# Altium schematic sheet STM32F7.SchDoc
size A3; SheetSize: A4
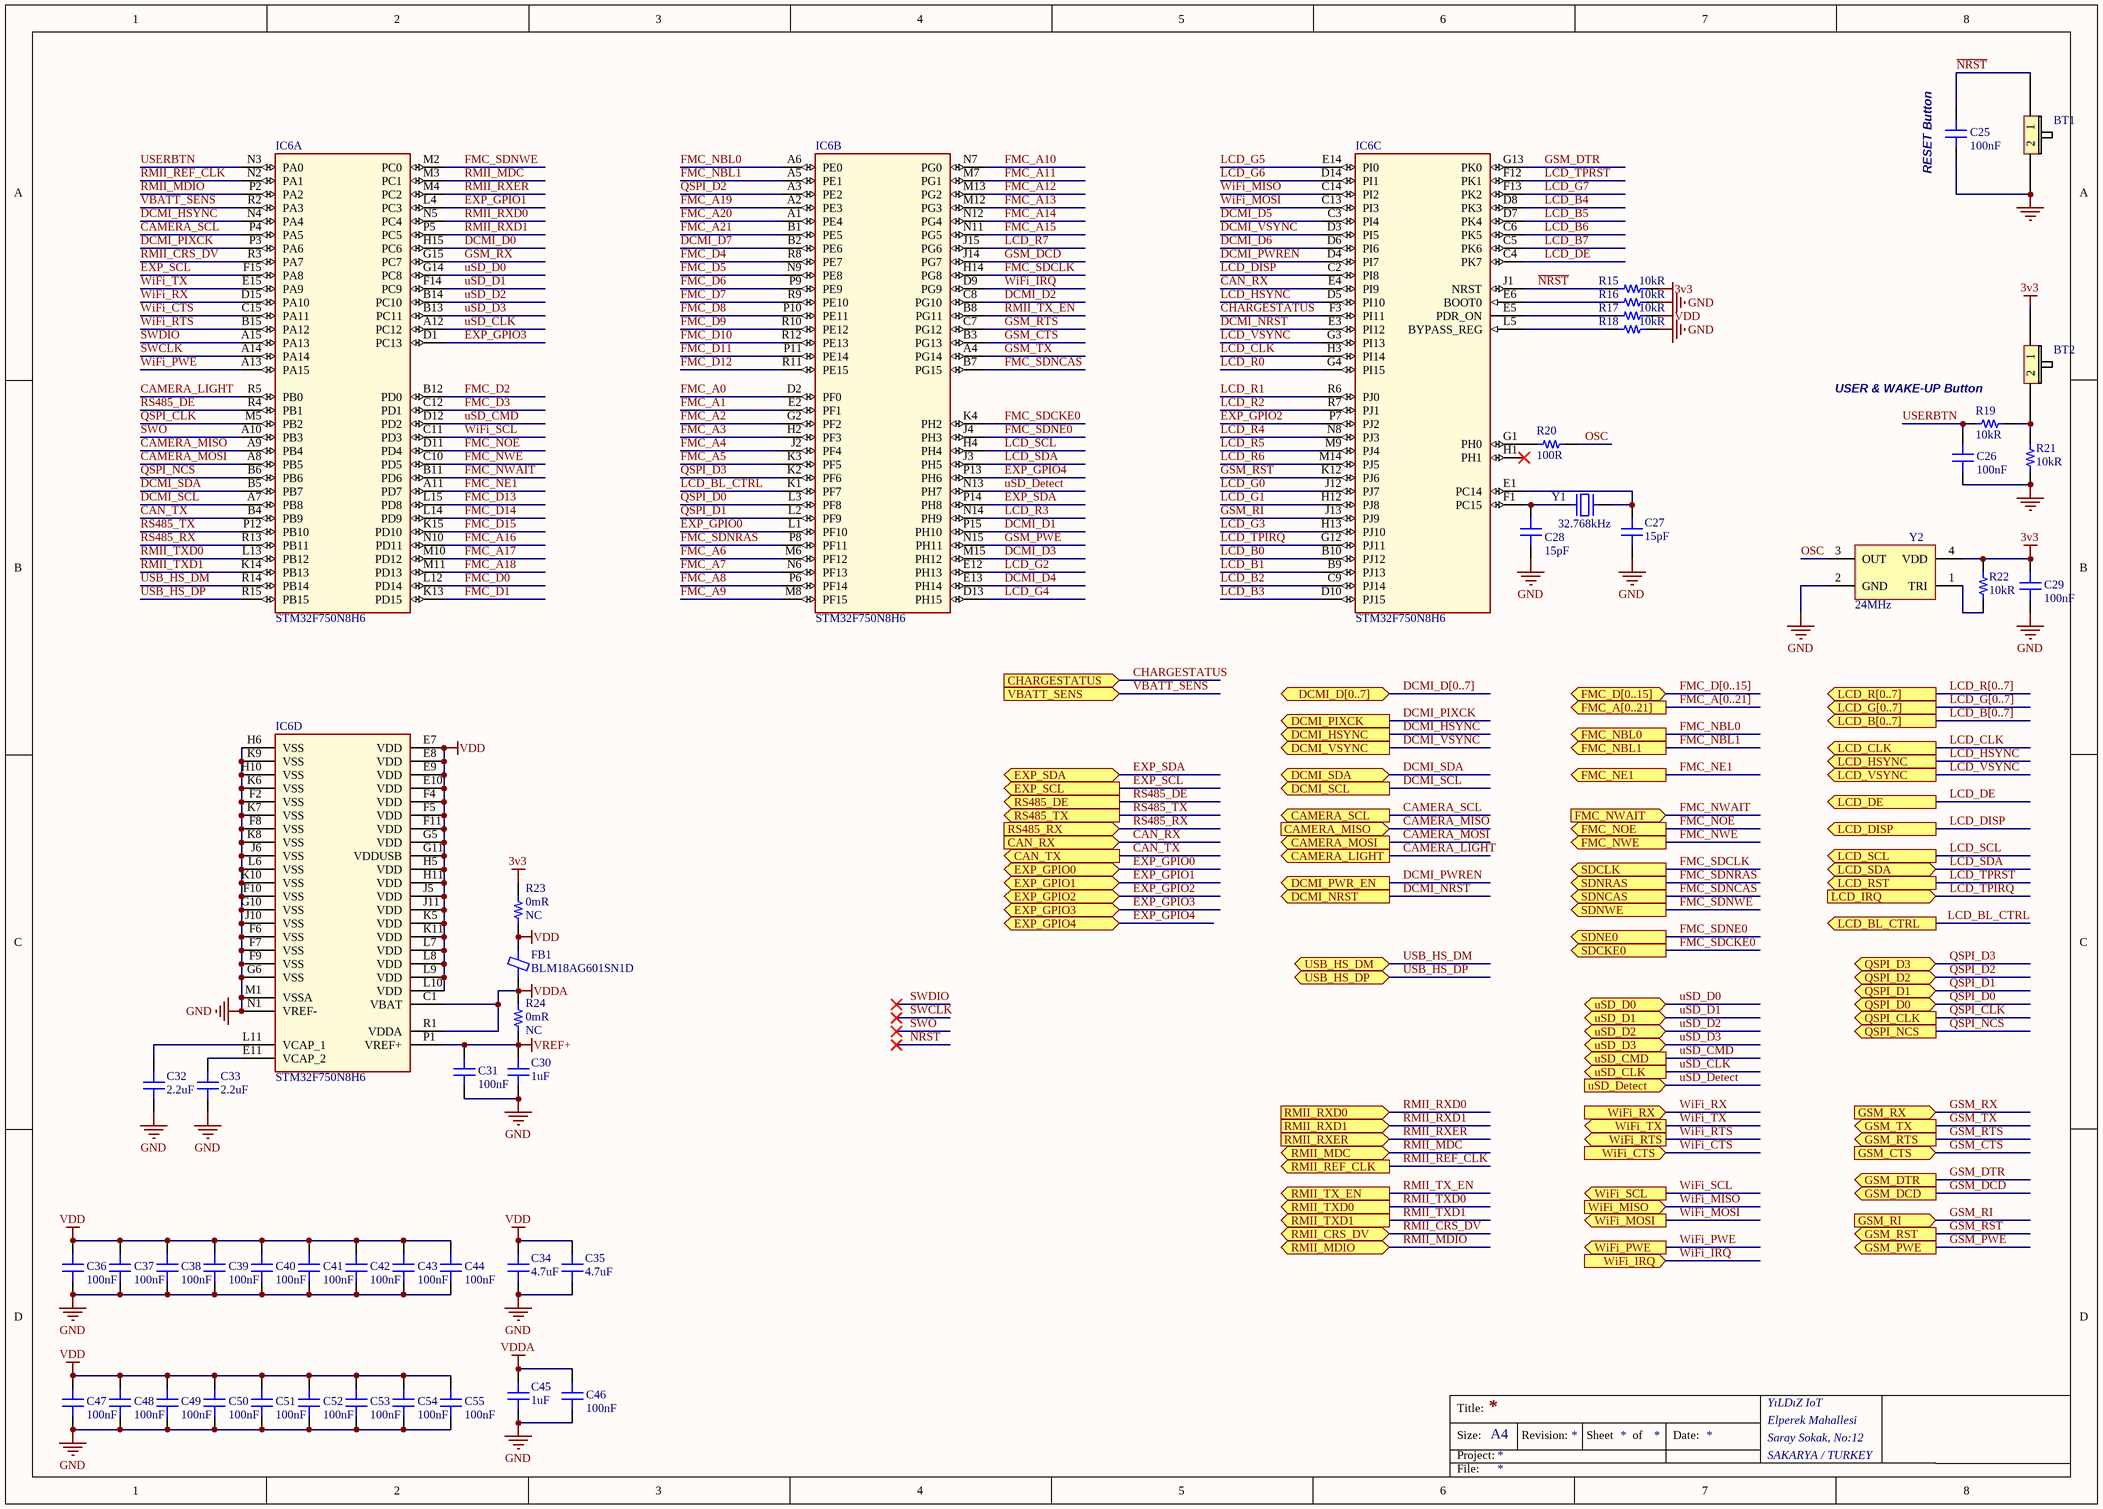
[diagram p0: STM32F7.SchDoc]

## Parts
BT1  EVQP7J01P  [TactileButton]  (value not drawn)
BT2  EVQP7J01P  [TactileButton]  (value not drawn)
C25  100nF  [CAP 0603/1608]  (no BOM)
C26  100nF  [CAP 0603/1608]
C27  15pF  [CAP 0603/1608]
C28  15pF  [CAP 0603/1608]
C29  100nF  [CAP 0603/1608]
C30  1uF  [CAP 0603/1608]
C31  100nF  [CAP 0603/1608]
C32  2.2uF  [CAP 0603/1608]
C33  2.2uF  [CAP 0603/1608]
C34  4.7uF  [CAP 0603/1608]
C35  4.7uF  [CAP 0603/1608]
C36  100nF  [CAP 0603/1608]
C37  100nF  [CAP 0603/1608]
C38  100nF  [CAP 0603/1608]
C39  100nF  [CAP 0603/1608]
C40  100nF  [CAP 0603/1608]
C41  100nF  [CAP 0603/1608]
C42  100nF  [CAP 0603/1608]
C43  100nF  [CAP 0603/1608]
C44  100nF  [CAP 0603/1608]
C45  1uF  [CAP 0603/1608]
C46  100nF  [CAP 0603/1608]
C47  100nF  [CAP 0603/1608]
C48  100nF  [CAP 0603/1608]
C49  100nF  [CAP 0603/1608]
C50  100nF  [CAP 0603/1608]
C51  100nF  [CAP 0603/1608]
C52  100nF  [CAP 0603/1608]
C53  100nF  [CAP 0603/1608]
C54  100nF  [CAP 0603/1608]
C55  100nF  [CAP 0603/1608]
FB1  BLM18AG601SN1D  [FER 0603/1608]
IC6  STM32F750N8H6  [ST TFBGA-216 13x13 0.8mm]  (parts A,B,C,D of 4)
R15  10kR  [RES 0603/1608]
R16  10kR  [RES 0603/1608]
R17  10kR  [RES 0603/1608]
R18  10kR  [RES 0603/1608]
R19  10kR  [RES 0603/1608]
R20  100R  [RES 0603/1608]  (no BOM)
R21  10kR  [RES 0603/1608]
R22  10kR  [RES 0603/1608]
R23  0mR  [RES 0603/1608]  (no BOM)
R24  0mR  [RES 0603/1608]  (no BOM)
Y1  32.768kHz  [ABRACON ABS06]
Y2  24MHz  [Abracon ASTX-11]

## Ports
CAMERA_LIGHT (out), CAMERA_MISO (in), CAMERA_MOSI (out), CAMERA_SCL (out), CAN_RX (in), CAN_TX (out), CHARGESTATUS (in), DCMI_D[0..7] (bidir), DCMI_HSYNC (out), DCMI_NRST (out), DCMI_PIXCK (out), DCMI_PWR_EN (out), DCMI_SCL (out), DCMI_SDA (bidir), DCMI_VSYNC (out), EXP_GPIO0 (bidir), EXP_GPIO1 (bidir), EXP_GPIO2 (bidir), EXP_GPIO3 (bidir), EXP_GPIO4 (bidir), EXP_SCL (out), EXP_SDA (bidir), FMC_A[0..21] (out), FMC_D[0..15] (bidir), FMC_NBL0 (out), FMC_NBL1 (out), FMC_NE1 (out), FMC_NOE (out), FMC_NWAIT (in), FMC_NWE (out), GSM_CTS (in), GSM_DCD (out), GSM_DTR (out), GSM_PWE (out), GSM_RI (in), GSM_RST (out), GSM_RTS (out), GSM_RX (in), GSM_TX (out), LCD_B[0..7] (out), LCD_BL_CTRL (out), LCD_CLK (out), LCD_DE (out), LCD_DISP (out), LCD_G[0..7] (out), LCD_HSYNC (out), LCD_IRQ (in), LCD_R[0..7] (out), LCD_RST (out), LCD_SCL (out), LCD_SDA (bidir), LCD_VSYNC (out), QSPI_CLK (out), QSPI_D0 (bidir), QSPI_D1 (bidir), QSPI_D2 (bidir), QSPI_D3 (bidir), QSPI_NCS (out), RMII_CRS_DV (bidir), RMII_MDC (bidir), RMII_MDIO (bidir), RMII_REF_CLK (out), RMII_RXD0 (in), RMII_RXD1 (in), RMII_RXER (in), RMII_TX_EN (out), RMII_TXD0 (out), RMII_TXD1 (out), RS485_DE (out), RS485_RX (in), RS485_TX (out), SDCKE0 (out), SDCLK (out), SDNCAS (out), SDNE0 (out), SDNRAS (out), SDNWE (out), USB_HS_DM (bidir), USB_HS_DP (bidir), uSD_CLK (out), uSD_CMD (out), uSD_D0 (bidir), uSD_D1 (bidir), uSD_D2 (bidir), uSD_D3 (bidir), uSD_Detect (in), VBATT_SENS (in), WiFi_CTS (in), WiFi_IRQ (in), WiFi_MISO (in), WiFi_MOSI (out), WiFi_PWE (out), WiFi_RTS (out), WiFi_RX (in), WiFi_SCL (out), WiFi_TX (out)

## Nets
3v3: BT2.1 C29.2 R15.1 R22.1 R23.2 Y2.4(VDD)
GND: BT1.2 C25.1 C26.1 C27.1 C28.1 C29.1 C30.1 C31.1 C32.1 C33.1 C34.1 C35.1 C36.1 C37.1 C38.1 C39.1 C40.1 C41.1 C42.1 C43.1 C44.1 C45.1 C46.1 C47.1 C48.1 C49.1 C50.1 C51.1 C52.1 C53.1 C54.1 C55.1 IC6.F2(VSS) IC6.F6(VSS) IC6.F7(VSS) IC6.F8(VSS) IC6.F9(VSS) IC6.F10(VSS) IC6.G6(VSS) IC6.G10(VSS) IC6.H6(VSS) IC6.H10(VSS) IC6.J6(VSS) IC6.J10(VSS) IC6.K6(VSS) IC6.K7(VSS) IC6.K8(VSS) IC6.K9(VSS) IC6.K10(VSS) IC6.L6(VSS) IC6.M1(VSSA) IC6.N1(VREF-) R16.1 R18.1 R21.1 Y2.2(GND)
VDD: C34.2 C35.2 C36.2 C37.2 C38.2 C39.2 C40.2 C41.2 C42.2 C43.2 C44.2 C47.2 C48.2 C49.2 C50.2 C51.2 C52.2 C53.2 C54.2 C55.2 FB1.2 IC6.E7(VDD) IC6.E8(VDD) IC6.E9(VDD) IC6.E10(VDD) IC6.F4(VDD) IC6.F5(VDD) IC6.F11(VDD) IC6.G5(VDD) IC6.G11(VDDUSB) IC6.H5(VDD) IC6.H11(VDD) IC6.J5(VDD) IC6.J11(VDD) IC6.K5(VDD) IC6.K11(VDD) IC6.L7(VDD) IC6.L8(VDD) IC6.L9(VDD) IC6.L10(VDD) R17.1 R23.1
VDDA: C45.2 C46.2 FB1.1 IC6.C1(VBAT) IC6.R1(VDDA) R24.2
VREF+: C30.2 C31.2 IC6.P1(VREF+) R24.1
CAMERA_LIGHT: IC6.R5(PB0) ; port CAMERA_LIGHT
CAMERA_MISO: IC6.A9(PB4) ; port CAMERA_MISO
CAMERA_MOSI: IC6.A8(PB5) ; port CAMERA_MOSI
CAMERA_SCL: IC6.P4(PA5) ; port CAMERA_SCL
CAN_RX: IC6.E4(PI9) ; port CAN_RX
CAN_TX: IC6.B4(PB9) ; port CAN_TX
CHARGESTATUS: IC6.F3(PI11) ; port CHARGESTATUS
DCMI_D0: IC6.H15(PC6)
DCMI_D1: IC6.P15(PH10)
DCMI_D2: IC6.C8(PG10)
DCMI_D3: IC6.M15(PH12)
DCMI_D4: IC6.E13(PH14)
DCMI_D5: IC6.C3(PI4)
DCMI_D6: IC6.D6(PI6)
DCMI_D7: IC6.B2(PE6)
DCMI_HSYNC: IC6.N4(PA4) ; port DCMI_HSYNC
DCMI_NRST: IC6.E3(PI12) ; port DCMI_NRST
DCMI_PIXCK: IC6.P3(PA6) ; port DCMI_PIXCK
DCMI_PWREN: IC6.D4(PI7) ; port DCMI_PWR_EN
DCMI_SCL: IC6.A7(PB8) ; port DCMI_SCL
DCMI_SDA: IC6.B5(PB7) ; port DCMI_SDA
DCMI_VSYNC: IC6.D3(PI5) ; port DCMI_VSYNC
EXP_GPIO0: IC6.L1(PF10) ; port EXP_GPIO0
EXP_GPIO1: IC6.L4(PC3) ; port EXP_GPIO1
EXP_GPIO2: IC6.P7(PJ2) ; port EXP_GPIO2
EXP_GPIO3: IC6.D1(PC13) ; port EXP_GPIO3
EXP_GPIO4: IC6.P13(PH6) ; port EXP_GPIO4
EXP_SCL: IC6.F15(PA8) ; port EXP_SCL
EXP_SDA: IC6.P14(PH8) ; port EXP_SDA
FMC_A0: IC6.D2(PF0)
FMC_A1: IC6.E2(PF1)
FMC_A2: IC6.G2(PF2)
FMC_A3: IC6.H2(PF3)
FMC_A4: IC6.J2(PF4)
FMC_A5: IC6.K3(PF5)
FMC_A6: IC6.M6(PF12)
FMC_A7: IC6.N6(PF13)
FMC_A8: IC6.P6(PF14)
FMC_A9: IC6.M8(PF15)
FMC_A10: IC6.N7(PG0)
FMC_A11: IC6.M7(PG1)
FMC_A12: IC6.M13(PG2)
FMC_A13: IC6.M12(PG3)
FMC_A14: IC6.N12(PG4)
FMC_A15: IC6.N11(PG5)
FMC_A16: IC6.N10(PD11)
FMC_A17: IC6.M10(PD12)
FMC_A18: IC6.M11(PD13)
FMC_A19: IC6.A2(PE3)
FMC_A20: IC6.A1(PE4)
FMC_A21: IC6.B1(PE5)
FMC_D0: IC6.L12(PD14)
FMC_D1: IC6.K13(PD15)
FMC_D2: IC6.B12(PD0)
FMC_D3: IC6.C12(PD1)
FMC_D4: IC6.R8(PE7)
FMC_D5: IC6.N9(PE8)
FMC_D6: IC6.P9(PE9)
FMC_D7: IC6.R9(PE10)
FMC_D8: IC6.P10(PE11)
FMC_D9: IC6.R10(PE12)
FMC_D10: IC6.R12(PE13)
FMC_D11: IC6.P11(PE14)
FMC_D12: IC6.R11(PE15)
FMC_D13: IC6.L15(PD8)
FMC_D14: IC6.L14(PD9)
FMC_D15: IC6.K15(PD10)
FMC_NBL0: IC6.A6(PE0) ; port FMC_NBL0
FMC_NBL1: IC6.A5(PE1) ; port FMC_NBL1
FMC_NE1: IC6.A11(PD7) ; port FMC_NE1
FMC_NOE: IC6.D11(PD4) ; port FMC_NOE
FMC_NWAIT: IC6.B11(PD6) ; port FMC_NWAIT
FMC_NWE: IC6.C10(PD5) ; port FMC_NWE
FMC_SDCKE0: IC6.K4(PH2) ; port SDCKE0
FMC_SDCLK: IC6.H14(PG8) ; port SDCLK
FMC_SDNCAS: IC6.B7(PG15) ; port SDNCAS
FMC_SDNE0: IC6.J4(PH3) ; port SDNE0
FMC_SDNRAS: IC6.P8(PF11) ; port SDNRAS
FMC_SDNWE: IC6.M2(PC0) ; port SDNWE
GSM_CTS: IC6.B3(PG13) ; port GSM_CTS
GSM_DCD: IC6.J14(PG7) ; port GSM_DCD
GSM_DTR: IC6.G13(PK0) ; port GSM_DTR
GSM_PWE: IC6.N15(PH11) ; port GSM_PWE
GSM_RI: IC6.J13(PJ9) ; port GSM_RI
GSM_RST: IC6.K12(PJ6) ; port GSM_RST
GSM_RTS: IC6.C7(PG12) ; port GSM_RTS
GSM_RX: IC6.G15(PC7) ; port GSM_RX
GSM_TX: IC6.A4(PG14) ; port GSM_TX
LCD_B0: IC6.B10(PJ12)
LCD_B1: IC6.B9(PJ13)
LCD_B2: IC6.C9(PJ14)
LCD_B3: IC6.D10(PJ15)
LCD_B4: IC6.D8(PK3)
LCD_B5: IC6.D7(PK4)
LCD_B6: IC6.C6(PK5)
LCD_B7: IC6.C5(PK6)
LCD_BL_CTRL: IC6.K1(PF7) ; port LCD_BL_CTRL
LCD_CLK: IC6.H3(PI14) ; port LCD_CLK
LCD_DE: IC6.C4(PK7) ; port LCD_DE
LCD_DISP: IC6.C2(PI8) ; port LCD_DISP
LCD_G0: IC6.J12(PJ7)
LCD_G1: IC6.H12(PJ8)
LCD_G2: IC6.E12(PH13)
LCD_G3: IC6.H13(PJ10)
LCD_G4: IC6.D13(PH15)
LCD_G5: IC6.E14(PI0)
LCD_G6: IC6.D14(PI1)
LCD_G7: IC6.F13(PK2)
LCD_HSYNC: IC6.D5(PI10) ; port LCD_HSYNC
LCD_R0: IC6.G4(PI15)
LCD_R1: IC6.R6(PJ0)
LCD_R2: IC6.R7(PJ1)
LCD_R3: IC6.N14(PH9)
LCD_R4: IC6.N8(PJ3)
LCD_R5: IC6.M9(PJ4)
LCD_R6: IC6.M14(PJ5)
LCD_R7: IC6.J15(PG6)
LCD_SCL: IC6.H4(PH4) ; port LCD_SCL
LCD_SDA: IC6.J3(PH5) ; port LCD_SDA
LCD_TPIRQ: IC6.G12(PJ11) ; port LCD_IRQ
LCD_TPRST: IC6.F12(PK1) ; port LCD_RST
LCD_VSYNC: IC6.G3(PI13) ; port LCD_VSYNC
~{NRST}: BT1.1 C25.2 IC6.J1(NRST) R15.2
OSC: R20.2 Y2.3(OUT)
QSPI_CLK: IC6.M5(PB2) ; port QSPI_CLK
QSPI_D0: IC6.L3(PF8) ; port QSPI_D0
QSPI_D1: IC6.L2(PF9) ; port QSPI_D1
QSPI_D2: IC6.A3(PE2) ; port QSPI_D2
QSPI_D3: IC6.K2(PF6) ; port QSPI_D3
QSPI_NCS: IC6.B6(PB6) ; port QSPI_NCS
RMII_CRS_DV: IC6.R3(PA7) ; port RMII_CRS_DV
RMII_MDC: IC6.M3(PC1) ; port RMII_MDC
RMII_MDIO: IC6.P2(PA2) ; port RMII_MDIO
RMII_REF_CLK: IC6.N2(PA1) ; port RMII_REF_CLK
RMII_RXD0: IC6.N5(PC4) ; port RMII_RXD0
RMII_RXD1: IC6.P5(PC5) ; port RMII_RXD1
RMII_RXER: IC6.M4(PC2) ; port RMII_RXER
RMII_TX_EN: IC6.B8(PG11) ; port RMII_TX_EN
RMII_TXD0: IC6.L13(PB12) ; port RMII_TXD0
RMII_TXD1: IC6.K14(PB13) ; port RMII_TXD1
RS485_DE: IC6.R4(PB1) ; port RS485_DE
RS485_RX: IC6.R13(PB11) ; port RS485_RX
RS485_TX: IC6.P12(PB10) ; port RS485_TX
SWCLK: IC6.A14(PA14)
SWDIO: IC6.A15(PA13)
SWO: IC6.A10(PB3)
USB_HS_DM: IC6.R14(PB14) ; port USB_HS_DM
USB_HS_DP: IC6.R15(PB15) ; port USB_HS_DP
uSD_CLK: IC6.A12(PC12) ; port uSD_CLK
uSD_CMD: IC6.D12(PD2) ; port uSD_CMD
uSD_D0: IC6.G14(PC8) ; port uSD_D0
uSD_D1: IC6.F14(PC9) ; port uSD_D1
uSD_D2: IC6.B14(PC10) ; port uSD_D2
uSD_D3: IC6.B13(PC11) ; port uSD_D3
uSD_Detect: IC6.N13(PH7) ; port uSD_Detect
USERBTN: C26.2 IC6.N3(PA0) R19.2
VBATT_SENS: IC6.R2(PA3) ; port VBATT_SENS
WiFi_CTS: IC6.C15(PA11) ; port WiFi_CTS
WiFi_IRQ: IC6.D9(PG9) ; port WiFi_IRQ
WiFi_MISO: IC6.C14(PI2) ; port WiFi_MISO
WiFi_MOSI: IC6.C13(PI3) ; port WiFi_MOSI
WiFi_PWE: IC6.A13(PA15) ; port WiFi_PWE
WiFi_RTS: IC6.B15(PA12) ; port WiFi_RTS
WiFi_RX: IC6.D15(PA10) ; port WiFi_RX
WiFi_SCL: IC6.C11(PD3) ; port WiFi_SCL
WiFi_TX: IC6.E15(PA9) ; port WiFi_TX
NetBT2_2: BT2.2 R19.1 R21.2
NetC27_2: C27.2 IC6.E1(PC14) Y1.2
NetC28_2: C28.2 IC6.F1(PC15) Y1.1
NetC32_2: C32.2 IC6.L11(VCAP_1)
NetC33_2: C33.2 IC6.E11(VCAP_2)
NetIC6_E5: IC6.E5(PDR_ON) R17.2
NetIC6_E6: IC6.E6(BOOT0) R16.2
NetIC6_G1: IC6.G1(PH0) R20.1
NetIC6_L5: IC6.L5(BYPASS_REG) R18.2
NetR22_2: R22.2 Y2.1(TRI)

Not connected (* = marked no-connect by the designer): IC6 H1(PH1)*

## Buses and harness runs
bus DCMI_D[0..7] = port DCMI_D[0..7]
bus FMC_A[0..21] = port FMC_A[0..21]
bus FMC_D[0..15] = port FMC_D[0..15]
bus LCD_B[0..7] = port LCD_B[0..7]
bus LCD_G[0..7] = port LCD_G[0..7]
bus LCD_R[0..7] = port LCD_R[0..7]

## Notes on the sheet
- (near C25) RESET Button
- USER & WAKE-UP Button
- Title:
- Size:
- Project:
- Revision:
- Sheet
- of
- Date:
- YıLDıZ IoT
- Elperek Mahallesi
- Saray Sokak, No:12
- SAKARYA / TURKEY
- File:

## Library data of the parts
BT1 BT2 = Button: Button, 2 pin; Manufacturer: Panasonic; Mechanical Life: 100000Cycles; Operating Force: 1.6N; Current Rating: 50mA; Voltage Rating (DC): 12V; Throw Configuration: SPST; Contact Resistance: 500mR; Illumination Type: Non-Illuminated; Switch Travel: 0.2mm; Switch Function: Off-Mom; Actuator Length: 0.65mm; Supplier 1: Digi-Key; Supplier Part Number 1: P16767CT-ND; Manufacturer Part Number: EVQP7J01P; Stock 1: 23697; Pricing 1: 1 = 0,30000, 10 = 0,28600, 25 = 0,27600, 50 = 0,26560, 100 = 0,25550, 250 = 0,23504, 500 = 0,20438, 1000 = 0,17372 (USD); RoHS: Yes; Mount: Surface Mount; Case/Package: SMD/SMT; Min Operating Temperature: -20°C; Max Operating Temperature: 70°C; Package Quantity: 5000; Packaging: Tape and Reel; Max Voltage Rating (DC): 12V; Termination: Gull Wing; Contact Current Rating: 50mA; Electrical Life: 100000Cycles; Orientation: Right Angle; Length: 3.5mm; Height: 1.35mm; Width: 2.9mm; Radiation Hardening: No; REACH SVHC: No SVHC; Lead Free: Lead Free; ComponentLink1URL: https://datasheet.ciiva.com/24076/atv0000ce4-259034-24076561.pdf?src-supplier=Mouser; ComponentLink1Description: https://datasheet.ciiva.com/24076/atv0000ce4-259034-24076561.pdf?src-supplier=Mouser; ComponentLink2URL: https://datasheet.ciiva.com/29974/atk0000ce20-29974069.pdf?src-supplier=Avnet; ComponentLink2Description: https://datasheet.ciiva.com/29974/atk0000ce20-29974069.pdf?src-supplier=Avnet; ComponentLink3URL: https://datasheet.ciiva.com/22777/atk0000ce20-22777575.pdf?src-supplier=Farnell; ComponentLink3Description: https://datasheet.ciiva.com/22777/atk0000ce20-22777575.pdf?src-supplier=Farnell; ComponentLink4URL: https://datasheet.ciiva.com/30252/atk0000ce20-30252044.pdf?src-supplier=Onlinecomponents.com; ComponentLink4Description: https://datasheet.ciiva.com/30252/atk0000ce20-30252044.pdf?src-supplier=Onlinecomponents.com
C25 C26 C29 C31 C36-C44 C46-C55 = Capacitor - Ceramic: Ceramic, SMT Capacitor; Manufacturer: Samsung; Manufacturer Part Number: CL10B104JB8NNNC; Tolerance: 5%; Voltage Rating: 50V; Dielectric: X7R; Supplier 1: Digi-Key; Supplier Part Number 1: 1276-1033-1-ND; Stock 1: 223594; Pricing 1: 1 = 0,10000, 10 = 0,05300, 100 = 0,02350, 500 = 0,01680, 1000 = 0,01320 (USD); RoHS: Yes; Mount: Surface Mount; Case/Package: 0603; Case Code (Metric): 1608; Case Code (Imperial): 0603; Material: Ceramic; Contact Plating: Tin; Min Operating Temperature: -55°C; Max Operating Temperature: 125°C; Packaging: Tape and Reel; Package Quantity: 1; Capacitance: 100nF; Voltage: 50V; Length: 1.6mm; Height: 0.8mm; Width: 0.031inch; Thickness: 0.035inch; Depth: 0.8mm; Radiation Hardening: No; ComponentLink1URL: https://media.digikey.com/pdf/Data%20Sheets/Samsung%20PDFs/CL_Series_MLCC_ds.pdf?src-supplier=Digi-Key; ComponentLink1Description: https://media.digikey.com/pdf/Data%20Sheets/Samsung%20PDFs/CL_Series_MLCC_ds.pdf?src-supplier=Digi-Key; ComponentLink2URL: https://www.verical.com/server-webapp/html/getDatasheet?partID=359321&src-supplier=Verical; ComponentLink2Description: https://www.verical.com/server-webapp/html/getDatasheet?partID=359321&src-supplier=Verical; ComponentLink3URL: http://www1.futureelectronics.com/doc/SAMSUNG/CL10B104JB8NNNC.pdf?src-supplier=Future+Electronics; ComponentLink3Description: http://www1.futureelectronics.com/doc/SAMSUNG/CL10B104JB8NNNC.pdf?src-supplier=Future+Electronics; ComponentLink4URL: https://produktinfo.conrad.com/datenblaetter/450000-474999/456613-da-01-en-VS_KONDENSATOR_0603.pdf?src-supplier=Conrad; ComponentLink4Description: https://produktinfo.conrad.com/datenblaetter/450000-474999/456613-da-01-en-VS_KONDENSATOR_0603.pdf?src-supplier=Conrad
C27 C28 = Capacitor - Ceramic: Ceramic, SMT Capacitor; Manufacturer: Walsin Technologies; Manufacturer Part Number: 0603N150J500CT; Tolerance: 5%; Dielectric: C0G; Voltage Rating: 50V; Supplier 1: Digi-Key; Supplier Part Number 1: 1292-1487-1-ND; Stock 1: 219118; Pricing 1: 1 = 0,10000, 10 = 0,03300, 100 = 0,01490, 500 = 0,01062, 1000 = 0,00835 (USD); RoHS: Yes; Case/Package: 0603; Case Code (Metric): 1608; Case Code (Imperial): 0603; Min Operating Temperature: -55°C; Max Operating Temperature: 125°C; Packaging: Tape and Reel; Capacitance: 15pF; Voltage Rating (DC): 50V; Length: 1.6mm; Depth: 0.8mm; REACH SVHC: Unknown; ComponentLink1URL: http://www.farnell.com/datasheets/1958513.pdf?src-supplier=Farnell; ComponentLink1Description: http://www.farnell.com/datasheets/1958513.pdf?src-supplier=Farnell; ComponentLink2URL: http://www.farnell.com/datasheets/2340522.pdf?src-supplier=Farnell; ComponentLink2Description: http://www.farnell.com/datasheets/2340522.pdf?src-supplier=Farnell; ComponentLink3URL: http://components.arrow.com/part/dataview/0323_03468609?src-supplier=Arrow+Europe; ComponentLink3Description: http://components.arrow.com/part/dataview/0323_03468609?src-supplier=Arrow+Europe; ComponentLink4URL: http://www.farnell.com/datasheets/1958513.pdf?src-supplier=Element14; ComponentLink4Description: http://www.farnell.com/datasheets/1958513.pdf?src-supplier=Element14
C30 C45 = Capacitor - Ceramic: Ceramic, SMT Capacitor; Manufacturer: Samsung; Manufacturer Part Number: CL10A105KP8NNNC; Tolerance: 10%; Voltage Rating: 10V; Dielectric: X5R; Supplier 1: Digi-Key; Supplier Part Number 1: 1276-1182-1-ND; Stock 1: 4590831; Pricing 1: 1 = 0,10000, 10 = 0,03800, 100 = 0,01680, 500 = 0,01200, 1000 = 0,00943 (USD); RoHS: Yes; Mount: Surface Mount; Case/Package: 0603; Case Code (Metric): 1608; Case Code (Imperial): 0603; Contact Plating: Tin; Min Operating Temperature: -55°C; Max Operating Temperature: 85°C; Packaging: Tape and Reel; Package Quantity: 1; Capacitance: 1uF; Voltage: 10V; Length: 1.6mm; Height: 0.8mm; Width: 0.031inch; Thickness: 0.035inch; Depth: 0.8mm; Radiation Hardening: No; ComponentLink1URL: https://datasheet.ciiva.com/15195/getdatasheetpartid-358616-15195708.pdf?src-supplier=Verical; ComponentLink1Description: https://datasheet.ciiva.com/15195/getdatasheetpartid-358616-15195708.pdf?src-supplier=Verical; ComponentLink2URL: https://datasheet.ciiva.com/16358/cl05b104kq5nnnc-16358431.pdf?src-supplier=Future+Electronics; ComponentLink2Description: https://datasheet.ciiva.com/16358/cl05b104kq5nnnc-16358431.pdf?src-supplier=Future+Electronics
C32 C33 = Capacitor - Ceramic: Ceramic, SMT Capacitor; Manufacturer: Samsung; Manufacturer Part Number: CL10A225KQ8NNNC; Tolerance: 10%; Voltage Rating: 6.3V; Dielectric: X5R; Supplier 1: Digi-Key; Supplier Part Number 1: 1276-1183-1-ND; Stock 1: 900644; Pricing 1: 1 = 0,11000, 10 = 0,07700, 100 = 0,03430, 500 = 0,02450, 1000 = 0,01925 (USD); RoHS: Yes; Mount: Surface Mount; Case/Package: 0603; Case Code (Metric): 1608; Case Code (Imperial): 0603; Contact Plating: Tin; Min Operating Temperature: -55°C; Max Operating Temperature: 85°C; Packaging: Tape and Reel; Capacitance: 2.2uF; Package Quantity: 1; Voltage: 6.3V; Voltage Rating (DC): 6.3V; Length: 1.6mm; Height: 0.8mm; Width: 0.031inch; Thickness: 0.035inch; Depth: 0.8mm; Radiation Hardening: No; Lead Free: Lead Free; ComponentLink1URL: https://datasheet.ciiva.com/15195/getdatasheetpartid-358618-15195712.pdf?src-supplier=Verical; ComponentLink1Description: https://datasheet.ciiva.com/15195/getdatasheetpartid-358618-15195712.pdf?src-supplier=Verical; ComponentLink2URL: https://datasheet.ciiva.com/16199/cl10a225kq8nnnc-16199203.pdf?src-supplier=Future+Electronics; ComponentLink2Description: https://datasheet.ciiva.com/16199/cl10a225kq8nnnc-16199203.pdf?src-supplier=Future+Electronics
C34 C35 = Capacitor - Ceramic: Ceramic, SMT Capacitor; Manufacturer: Samsung; Manufacturer Part Number: CL10A475MQ8NNNC; Tolerance: 20%; Voltage Rating: 6.3V; Dielectric: X5R; Supplier 1: Digi-Key; Supplier Part Number 1: 1276-1907-1-ND; Stock 1: 764729; Pricing 1: 1 = 0,10000, 10 = 0,06300, 100 = 0,02790, 500 = 0,01990, 1000 = 0,01564 (USD); RoHS: Yes; Mount: Surface Mount; Case/Package: 0603; Case Code (Metric): 1608; Case Code (Imperial): 0603; Min Operating Temperature: -55°C; Max Operating Temperature: 85°C; Capacitance: 4.7uF; Packaging: Tape and Reel; Package Quantity: 4000; Voltage Rating (DC): 6.3V; Length: 1.6mm; Height: 0.8mm; Width: 0.031inch; Thickness: 0.035inch; Depth: 0.8mm; Radiation Hardening: No; Lead Free: Lead Free; ComponentLink1URL: https://datasheet.ciiva.com/25713/cl10a475mq8nnnc-25713301.pdf?src-supplier=Digi-Key; ComponentLink1Description: https://datasheet.ciiva.com/25713/cl10a475mq8nnnc-25713301.pdf?src-supplier=Digi-Key; ComponentLink2URL: https://datasheet.ciiva.com/26838/getdatasheetpartid-358407-26838391.pdf?src-supplier=Verical; ComponentLink2Description: https://datasheet.ciiva.com/26838/getdatasheetpartid-358407-26838391.pdf?src-supplier=Verical; ComponentLink3URL: https://datasheet.ciiva.com/16437/cl05b104kq5nnnc-16437323.pdf?src-supplier=Future+Electronics; ComponentLink3Description: https://datasheet.ciiva.com/16437/cl05b104kq5nnnc-16437323.pdf?src-supplier=Future+Electronics
FB1 = Ferrite Chip: SMT Ferrite Chip; Manufacturer: Murata; Material: Steel; Frequency: 100MHz; Tolerance: 25%; Impedance: 600R; Max Current Rating: 500mA; Number of Lines: 1; DC Resistance (DCR): 380mR; Shielding: Unshielded; Supplier 1: Digi-Key; Supplier Part Number 1: 490-1014-1-ND; Manufacturer Part Number: BLM18AG601SN1D; Stock 1: 1151376; Pricing 1: 1 = 0,10000, 10 = 0,07900, 25 = 0,07200, 50 = 0,06480, 100 = 0,04760, 250 = 0,03460, 500 = 0,03170, 1000 = 0,02738 (USD); RoHS: Yes; Case/Package: 0603; Number of Pins: 2; Weight: 7.1E-05oz; Core Material: Ferrite; Case Code (Metric): 1608; Case Code (Imperial): 0603; Min Operating Temperature: -55°C; Max Operating Temperature: 125°C; Package Quantity: 1; Packaging: Tape and Reel; Current Rating: 500mA; Termination: SMD/SMT; Max DC Current: 500mA; Test Frequency: 100MHz; DC Current: 500mA; Military Standard: Not; Number of Circuits: 1; Length: 1.6mm; Height: 0.8mm; Width: 0.8mm; Depth: 0.8mm; Radiation Hardening: No; Lead Free: Lead Free; REACH SVHC: No SVHC; ComponentLink1URL: https://datasheet.ciiva.com/19460/1844766-19460213.pdf?src-supplier=Jameco; ComponentLink1Description: https://datasheet.ciiva.com/19460/1844766-19460213.pdf?src-supplier=Jameco; ComponentLink2URL: https://datasheet.ciiva.com/29347/442309-da-01-en-chip-drossel-0603-600r-500ma-1-6x0-8mm-29347900.pdf?src-supplier=Conrad; ComponentLink2Description: https://datasheet.ciiva.com/29347/442309-da-01-en-chip-drossel-0603-600r-500ma-1-6x0-8mm-29347900.pdf?src-supplier=Conrad; ComponentLink3URL: https://datasheet.ciiva.com/41449/001172228-da-01-en-drossel-0603-600r-1-6x0-8mm-4000st-41449517.pdf?src-supplier=Conrad; ComponentLink3Description: https://datasheet.ciiva.com/41449/001172228-da-01-en-drossel-0603-600r-1-6x0-8mm-4000st-41449517.pdf?src-supplier=Conrad; ComponentLink4URL: https://datasheet.ciiva.com/1012/l0110s0100blm18a-1012018.pdf?src-supplier=Digi-Key; ComponentLink4Description: https://datasheet.ciiva.com/1012/l0110s0100blm18a-1012018.pdf?src-supplier=Digi-Key; ComponentLink5URL: https://datasheet.ciiva.com/1012/l0110s0100blm18a-1012019.pdf?src-supplier=Digi-Key; ComponentLink5Description: https://datasheet.ciiva.com/1012/l0110s0100blm18a-1012019.pdf?src-supplier=Digi-Key; ComponentLink6URL: https://datasheet.ciiva.com/1466/1756147-1466934.pdf?src-supplier=Element14; ComponentLink6Description: https://datasheet.ciiva.com/1466/1756147-1466934.pdf?src-supplier=Element14; ComponentLink7URL: https://datasheet.ciiva.com/3081/l0110s0100blm18a-3081613.pdf?src-supplier=Avnet; ComponentLink7Description: https://datasheet.ciiva.com/3081/l0110s0100blm18a-3081613.pdf?src-supplier=Avnet; ComponentLink8URL: https://datasheet.ciiva.com/1012/l0110s0100blm18a-1012017.pdf?src-supplier=Digi-Key; ComponentLink8Description: https://datasheet.ciiva.com/1012/l0110s0100blm18a-1012017.pdf?src-supplier=Digi-Key; ComponentLink9URL: https://datasheet.ciiva.com/1466/1756147-1466933.pdf?src-supplier=Element14; ComponentLink9Description: https://datasheet.ciiva.com/1466/1756147-1466933.pdf?src-supplier=Element14; ComponentLink10URL: https://datasheet.ciiva.com/16210/l0110s0100blm18a-16210006.pdf?src-supplier=Future+Electronics; ComponentLink10Description: https://datasheet.ciiva.com/16210/l0110s0100blm18a-16210006.pdf?src-supplier=Future+Electronics
IC6 = ST STM32F75XNXH 216 PIN: Arm®-based Cortex®-M7 32b MCU+FPU, 462DMIPS, 64KB Flash/320+16+ 4KB RAM, USB OTG HS/FS, 25 com IF, Cam, LCD; Manufacturer: STMicroelectronics; ComponentLink1URL: https://www.st.com/resource/en/datasheet/stm32f750v8.pdf?src-supplier=Digi-Key; ComponentLink1Description: https://www.st.com/resource/en/datasheet/stm32f750v8.pdf?src-supplier=Digi-Key; Supplier 1: Digi-Key; Supplier Part Number 1: 497-18106-ND; Manufacturer Part Number: STM32F750N8H6; Stock 1: 61; Pricing 1: 1 = 9,70000, 10 = 8,76200, 25 = 8,35480, 100 = 7,25440, 250 = 6,92836, 500 = 6,31702, 1000 = 5,50193 (USD); RoHS: No
R15-R19 R21 R22 = Resistor_Chip: Ceramic, SMT Capacitor; Manufacturer: Stackpole Electronics; Manufacturer Part Number: RNCP0603FTD10K0; Tolerance: 1%; Max Power Dissipation: 125mW; Temperature Coefficient: 100ppm/°C; Supplier 1: Digi-Key; Supplier Part Number 1: RNCP0603FTD10K0CT-ND; Stock 1: 183083; Pricing 1: 1 = 0,10000, 10 = 0,06700, 100 = 0,02730, 1000 = 0,01224, 2500 = 0,01063 (USD); RoHS: Yes; Mount: Surface Mount; Case/Package: 0603; Case Code (Metric): 1608; Case Code (Imperial): 0603; Contact Plating: Matte,Tin; Min Operating Temperature: -55°C; Max Operating Temperature: 155°C; Packaging: Tape and Reel; Resistance: 10kR; Composition: Thin Film; Number of Terminations: 2; Features: Anti-Sulfur,Moisture Resistant; Length: 0.059inch; Height: 0.02inch; Width: 0.031inch; Radiation Hardening: No; Lead Free: Lead Free
R20 = Resistor_Chip: Ceramic, SMT Capacitor; Manufacturer: Stackpole Electronics; Manufacturer Part Number: RMCF0603FT100R; Power Rating: 100mW; Tolerance: 1%; Temperature Coefficient: 100ppm/°C; Supplier 1: Digi-Key; Supplier Part Number 1: RMCF0603FT100RCT-ND; Stock 1: 3526625; Pricing 1: 1 = 0,10000, 10 = 0,01700, 100 = 0,00680, 1000 = 0,00306, 2500 = 0,00266 (USD); RoHS: Yes; Mount: Surface Mount; Case/Package: 0603; Case Code (Metric): 1608; Case Code (Imperial): 0603; Contact Plating: Tin; Min Operating Temperature: -55°C; Max Operating Temperature: 155°C; Resistance: 100R; Packaging: Tape and Reel; Composition: Thick Film; Number of Terminations: 2; Military Standard: Not; Max Power Dissipation: 100mW; Features: Automotive AEC-Q200; Length: 1.55mm; Height: 0.022inch; Width: 0.031inch; Depth: 0.8mm; Radiation Hardening: No; Lead Free: Lead Free; ComponentLink1URL: https://datasheet.ciiva.com/15215/getdatasheetpartid-360413-15215981.pdf?src-supplier=Verical; ComponentLink1Description: https://datasheet.ciiva.com/15215/getdatasheetpartid-360413-15215981.pdf?src-supplier=Verical
R23 R24 = Resistor_Chip: Ceramic, SMT Capacitor; Manufacturer: Stackpole Electronics; Manufacturer Part Number: RMCF0603ZT0R00; Power Rating: 100mW; Current Rating: 1A; Working Voltage: 75V; Supplier 1: Digi-Key; Supplier Part Number 1: RMCF0603ZT0R00CT-ND; Stock 1: 3894946; Pricing 1: 1 = 0,10000, 10 = 0,01600, 25 = 0,01160, 50 = 0,00880, 100 = 0,00640, 250 = 0,00492, 500 = 0,00392, 1000 = 0,00289 (USD); RoHS: Yes; Mount: Surface Mount; Case/Package: 0603; Case Code (Metric): 1608; Case Code (Imperial): 0603; Contact Plating: Tin; Min Operating Temperature: -55°C; Max Operating Temperature: 155°C; Resistance: 0mR; Packaging: Tape and Reel; Composition: Thick Film; Number of Terminations: 2; Military Standard: Not; Max Power Dissipation: 100mW; Features: Automotive AEC-Q200; Length: 1.55mm; Height: 0.022inch; Width: 0.031inch; Depth: 0.8mm; Radiation Hardening: No; Lead Free: Lead Free; ComponentLink1URL: https://www.seielect.com/catalog/SEI-Packaging.pdf?src-supplier=Avnet; ComponentLink1Description: https://www.seielect.com/catalog/SEI-Packaging.pdf?src-supplier=Avnet; ComponentLink2URL: https://www.seielect.com/catalog/SEI-Packaging.pdf?src-supplier=Verical; ComponentLink2Description: https://www.seielect.com/catalog/SEI-Packaging.pdf?src-supplier=Verical; ComponentLink3URL: https://www.seielect.com/catalog/SEI-Packaging.pdf?src-supplier=Arrow; ComponentLink3Description: https://www.seielect.com/catalog/SEI-Packaging.pdf?src-supplier=Arrow; ComponentLink4URL: https://www.seielect.com/catalog/SEI-Packaging.pdf?src-supplier=Digi-Key; ComponentLink4Description: https://www.seielect.com/catalog/SEI-Packaging.pdf?src-supplier=Digi-Key; ComponentLink5URL: https://www.seielect.com/Catalog/SEI-RMCF_RMCP.pdf?src-supplier=Digi-Key; ComponentLink5Description: https://www.seielect.com/Catalog/SEI-RMCF_RMCP.pdf?src-supplier=Digi-Key; ComponentLink6URL: https://www.seielect.com/catalog/SEI-RMCF_RMCP.pdf?src-supplier=Avnet+Asia; ComponentLink6Description: https://www.seielect.com/catalog/SEI-RMCF_RMCP.pdf?src-supplier=Avnet+Asia; ComponentLink7URL: http://www.seielect.com/catalog/sei-rmc.pdf?src-supplier=Future+Electronics; ComponentLink7Description: http://www.seielect.com/catalog/sei-rmc.pdf?src-supplier=Future+Electronics; ComponentLink8URL: https://www.seielect.com/catalog/SEI-Packaging.pdf?src-supplier=Future+Electronics; ComponentLink8Description: https://www.seielect.com/catalog/SEI-Packaging.pdf?src-supplier=Future+Electronics; NC: NC
Y1 = ABS06-32.768KHZ-1-T: CRYSTAL 32.7680KHZ 12.5PF SMD; Manufacturer: Abracon LLC; Frequency Tolerance: 10ppm; ESR: 90 kOhm; Operating Mode: Fundamental; ESR (Equivalent Series Resistance): 90kR; Manufacturer Part Number: ABS06-32.768KHZ-1-T; PartId: 8532; Supplier 1: Digi-Key; ComponentLink1Description: Datasheet; ComponentLink1URL: http://www.abracon.com/Resonators/ABS06.pdf; ComponentLink2Description: Digi-Key Listing; ComponentLink2URL: http://www.digikey.com/product-detail/en/ABS06-32.768KHZ-1-T/535-10248-2-ND/2217994; Type: kHz Crystal (Tuning Fork); Device Package: 2-SMD; Frequency: 32.768kHz; Frequency Stability: -; Load Capacitance: 12.5pF; Supplier Part Number 1: 535-10248-1-ND; Stock 2: 63513; Pricing 1: 1 = 0,80000, 10 = 0,70800, 50 = 0,66220, 100 = 0,58520, 500 = 0,55440, 1000 = 0,46200 (USD); RoHS: Yes; Mount: Surface Mount; Case/Package: CSMD; Number of Pins: 2; Min Operating Temperature: -40°C; Max Operating Temperature: 85°C; Tolerance: 10ppm; Packaging: Tape and Reel; Package Quantity: 3000; Termination: SMD/SMT; Series Resistance: 90kR; Length: 2mm; Height: 0.024inch; Width: 1.2mm; Depth: 1.2mm; Radiation Hardening: No; REACH SVHC: No SVHC; Lead Free: Lead Free; ComponentLink3URL: https://datasheet.ciiva.com/15116/getdatasheetpartid-721079-15116832.pdf?src-supplier=Verical; ComponentLink3Description: https://datasheet.ciiva.com/15116/getdatasheetpartid-721079-15116832.pdf?src-supplier=Verical; ComponentLink4URL: https://datasheet.ciiva.com/7998/abs06-7998658.pdf?src-supplier=Element14; ComponentLink4Description: https://datasheet.ciiva.com/7998/abs06-7998658.pdf?src-supplier=Element14; ComponentLink5URL: https://datasheet.ciiva.com/1357/1796520-1357315.pdf?src-supplier=Element14; ComponentLink5Description: https://datasheet.ciiva.com/1357/1796520-1357315.pdf?src-supplier=Element14; ComponentLink6URL: https://datasheet.ciiva.com/28508/1912788-28508597.pdf?src-supplier=Element14; ComponentLink6Description: https://datasheet.ciiva.com/28508/1912788-28508597.pdf?src-supplier=Element14; ComponentLink7URL: https://datasheet.ciiva.com/856/abs06-856604.pdf?src-supplier=Digi-Key; ComponentLink7Description: https://datasheet.ciiva.com/856/abs06-856604.pdf?src-supplier=Digi-Key; ComponentLink8URL: https://datasheet.ciiva.com/3176/abs06-3176156.pdf?src-supplier=Avnet; ComponentLink8Description: https://datasheet.ciiva.com/3176/abs06-3176156.pdf?src-supplier=Avnet; ComponentLink9URL: https://datasheet.ciiva.com/856/abs06-856605.pdf?src-supplier=Digi-Key; ComponentLink9Description: https://datasheet.ciiva.com/856/abs06-856605.pdf?src-supplier=Digi-Key; ComponentLink10URL: https://datasheet.ciiva.com/856/abs06-856606.pdf?src-supplier=Digi-Key; ComponentLink10Description: https://datasheet.ciiva.com/856/abs06-856606.pdf?src-supplier=Digi-Key
Y2 = ASD1-1.544MHZ-EC-T: OSC XO 1.544MHZ CMOS SMD; Manufacturer: ECS Inc.; Manufacturer Part Number: ECS-3225MV-240-CN-TR; Base Resonator: Crystal; Function: Enable/Disable; Output: HCMOS; Voltage - Supply: 1.62V ~ 3.63V; Frequency Stability: ±25ppm; ComponentLink1Description: Datasheet; ComponentLink1URL: http://www.abracon.com/Oscillators/ASDseries.pdf; ComponentLink2Description: Digi-Key Listing; ComponentLink2URL: https://www.digikey.com/product-detail/en/ASD1-1.544MHZ-EC-T/535-9579-2-ND/1236896; Supplier 1: Digi-Key; Supplier Part Number 1: XC2884CT-ND; Stock 1: 1655; Pricing 1: 1 = 0,92000, 10 = 0,81700, 50 = 0,76380, 100 = 0,67510, 500 = 0,63954 (USD); RoHS: No; ComponentLink3URL: https://www.ecsxtal.com/store/pdf/ECS-3225MV.pdf?src-supplier=Digi-Key; ComponentLink3Description: https://www.ecsxtal.com/store/pdf/ECS-3225MV.pdf?src-supplier=Digi-Key; Packaging: Cut Tape (CT); Type: XO (Standard); Frequency: 24MHz; Series: ECS-3225MV